# EAGLE board otterley_B_v1_2 (EAGLE 9.6.2)
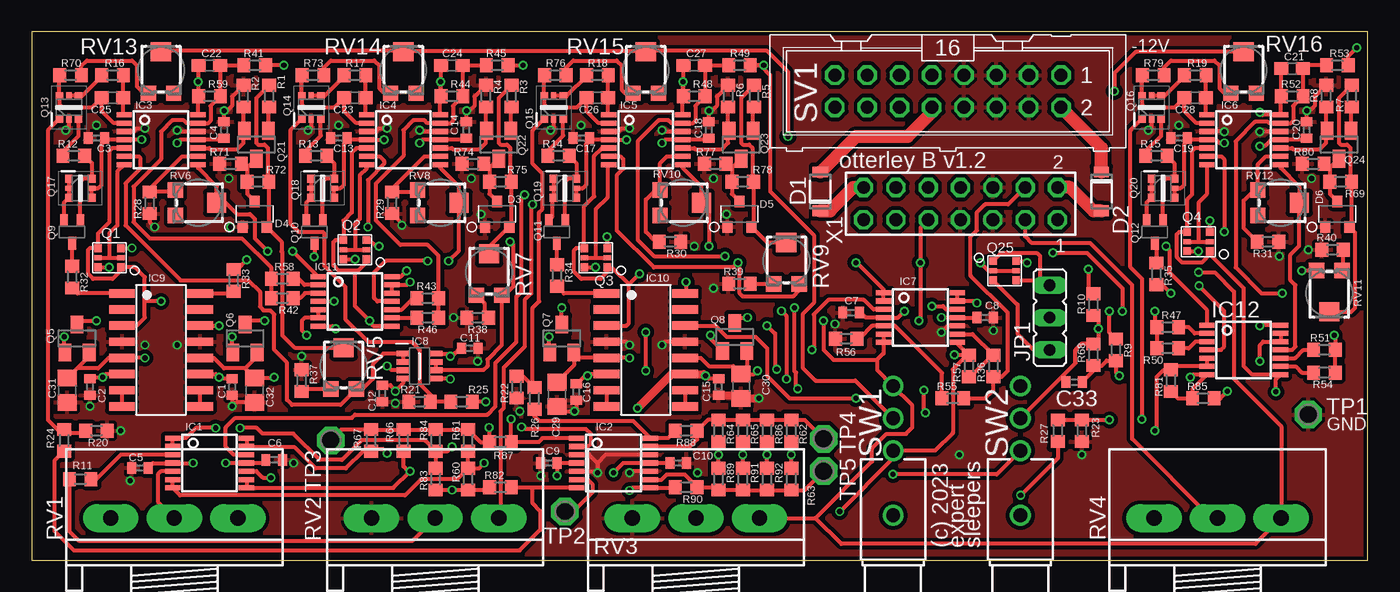
[diagram p6: board, top side]
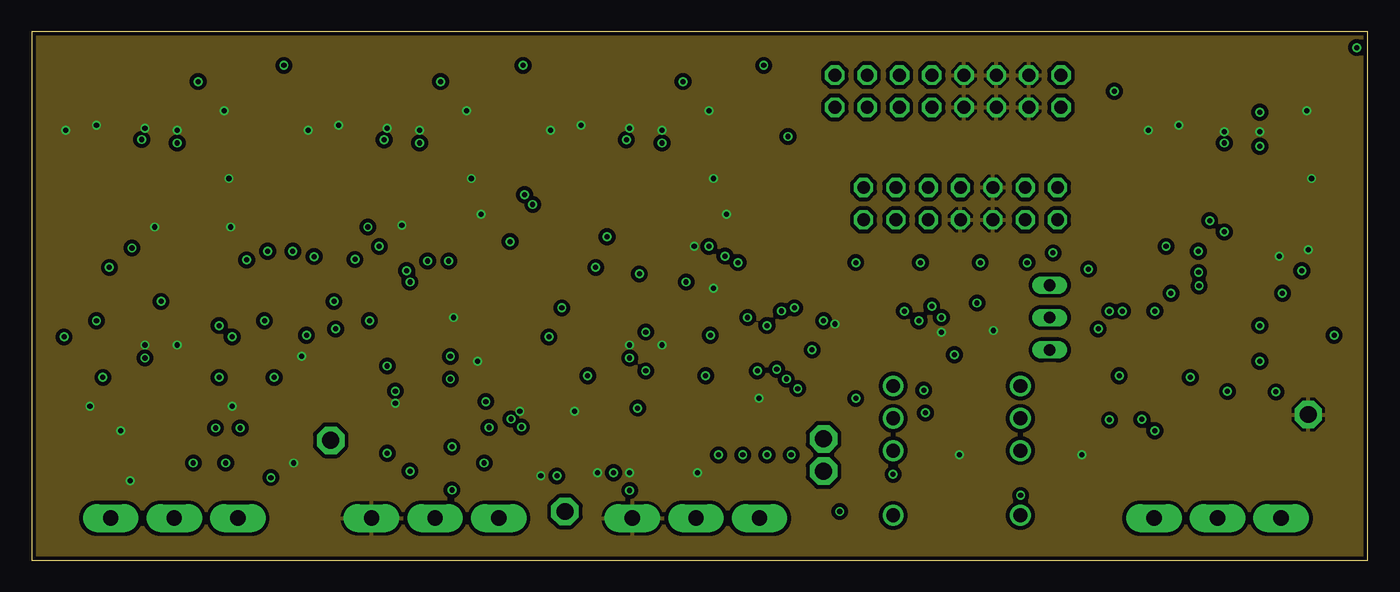
[diagram p7: board, inner layer Route2]
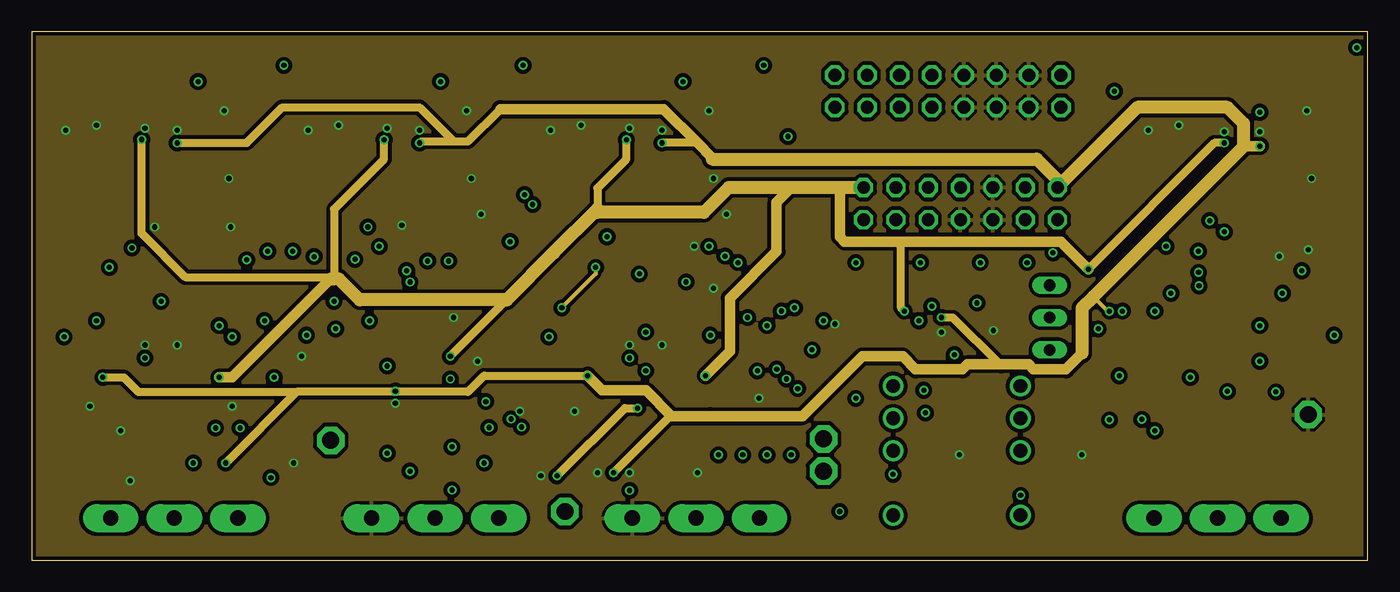
[diagram p8: board, inner layer Route15]
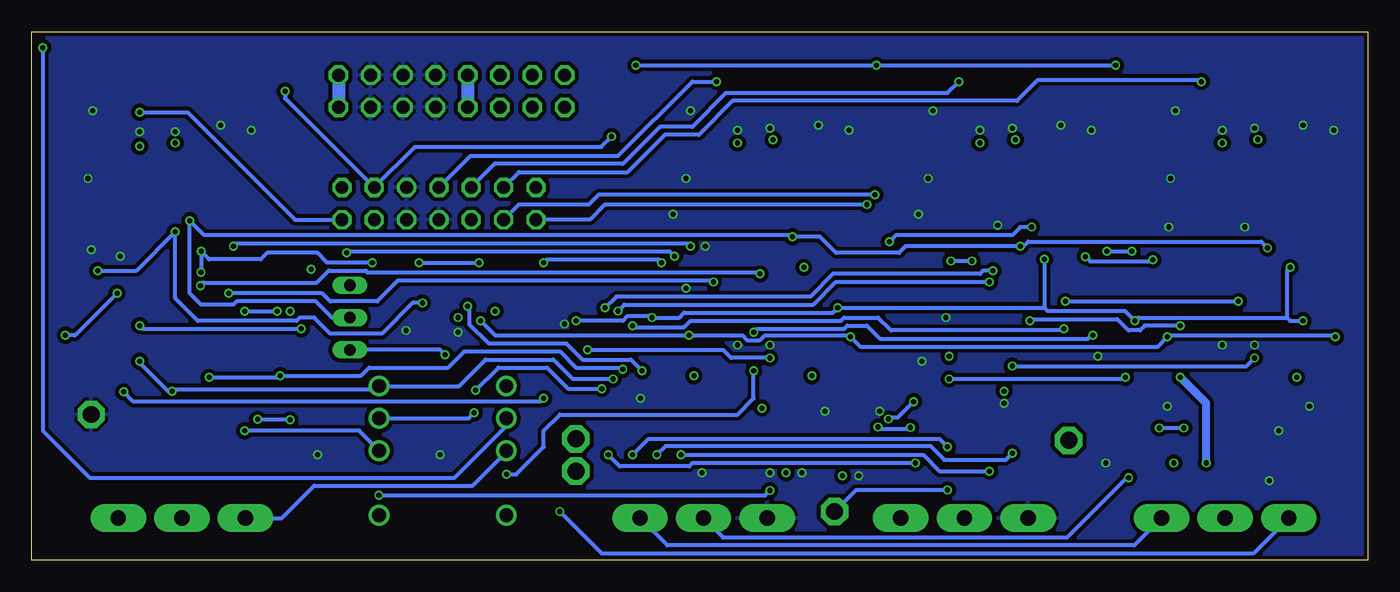
[diagram p9: board, bottom side, seen from below]

Size 105 x 41.5 mm. Coordinates in mm from the lower left corner, seen from the top.
Outline: 0,0 105,0 105,41.5 0,41.5 0,0
Copper layers (1+2*15+16): Top 0.035mm / dielectric 0.25mm / Route2 0.035mm / dielectric 1mm / Route15 0.035mm / dielectric 0.25mm / Bottom 0.035mm
Design rules "pcbtrain *": minimum track width 5mil, minimum drill 0.4mm, track to track 5mil, track to pad 5mil, pad to pad 5mil, via to via 5mil, smd to smd 5mil, copper to edge 0.25mm, drill to drill 8mil, minimum pad ring 0.15mm, minimum via ring 0.15mm, stop-mask expansion 4mil, vias tented up to drill 0mil, thermal gap 10mil

## Footprints (pad centres in the part's own frame; a part is rotated, then mirrored left to right if it is on the bottom)
C0402 = smd 0.7 x 0.9: 1 -0.65,0; 2 0.65,0
C0603 = smd 1.1 x 1: 1 -0.85,0; 2 0.85,0
C0805 = smd 1.3 x 1.5: 1 -0.95,0; 2 0.95,0
SOD123FL = smd 0.85 x 1.2: A 1.525,0; C -1.525,0
SOT-23 = smd 0.8 x 0.9: 1 -0.95,-1; 2 0.95,-1; 3 0,1
PW_R-PDSO-G14 = smd 0.4 x 1.2: 1 -1.95,-2.9; 2 -1.3,-2.9; 3 -0.65,-2.9; 4 0,-2.9; 5 0.65,-2.9; 6 1.3,-2.9; 7 1.95,-2.9; 8 1.95,2.9; 9 1.3,2.9; 10 0.65,2.9; 11 0,2.9; 12 -0.65,2.9; 13 -1.3,2.9; 14 -1.95,2.9
DDF0008A = smd 1.05 x 0.45: 1 -1.3,0.975; 2 -1.3,0.325; 3 -1.3,-0.325; 4 -1.3,-0.975; 5 1.3,-0.975; 6 1.3,-0.325; 7 1.3,0.325; 8 1.3,0.975
SO16 = smd 0.66 x 2.032: 1 -4.445,-3.073; 2 -3.175,-3.073; 3 -1.905,-3.073; 4 -0.635,-3.073; 5 0.635,-3.073; 6 1.905,-3.073; 7 3.175,-3.073; 8 4.445,-3.073; 9 4.445,3.073; 10 3.175,3.073; 11 1.905,3.073; 12 0.635,3.073; 13 -0.635,3.073; 14 -1.905,3.073; 15 -3.175,3.073; 16 -4.445,3.073
JP2 = drill 0.914 long: 1 -2.54,0; 2 0,0; 3 2.54,0
SOT363 = smd 0.6 x 0.6: 1 -0.9,0.75; 3 -0.9,-0.75; 4 0.9,-0.75; 6 0.9,0.75 | smd 0.6 x 0.4: 2 -0.9,0; 5 0.9,0
SOT23 = smd 1 x 1.4: 1 -0.95,-1.1; 2 0.95,-1.1; 3 0,1.1
SOT323 = smd 0.6 x 1: 1 -0.65,-0.9; 2 0.65,-0.9; 3 0,0.9
SOT65P210X110-6N = smd 0.6 x 0.6: 1 -0.9,0.75; 3 -0.9,-0.75; 4 0.9,-0.75; 6 0.9,0.75 | smd 0.6 x 0.4: 2 -0.9,0; 5 0.9,0
R0603 = smd 1 x 1.1: 1 -0.85,0; 2 0.85,0
RD1610NOA0X = drill 1.2 pad 2.184 long: 1 -5,3.8; 2 0,3.8; 3 5,3.8
TC33X = smd 1.2 x 1.2: 1 -1,-1.8; 3 1,-1.8 | smd 1.6 x 1.5: 2 0,1.45
ML16 = drill 1.016 octagon: 1 -8.89,-1.27; 2 -8.89,1.27; 3 -6.35,-1.27; 4 -6.35,1.27; 5 -3.81,-1.27; 6 -3.81,1.27; 7 -1.27,-1.27; 8 -1.27,1.27; 9 1.27,-1.27; 10 1.27,1.27; 11 3.81,-1.27; 12 3.81,1.27; 13 6.35,-1.27; 14 6.35,1.27; 15 8.89,-1.27; 16 8.89,1.27
2MS1T2B2M7RE = drill 1.092: 1 0,5.08; 2 0,7.62; 3 0,10.16; 7 0,0
P1-13 = drill 1.321 pad 2.159 octagon: TP 0,0
TSW-107-02-S-D = drill 1 pad 1.5 octagon: 1 7.62,-1.27; 2 7.62,1.27; 3 5.08,-1.27; 4 5.08,1.27; 5 2.54,-1.27; 6 2.54,1.27; 7 0,-1.27; 8 0,1.27; 9 -2.54,-1.27; 10 -2.54,1.27; 11 -5.08,-1.27; 12 -5.08,1.27; 13 -7.62,-1.27; 14 -7.62,1.27

## Placement (x,y rotation side)
C1  0.1uF  [C0402]  15.75,13.59 270 top
C2  0.1uF  [C0402]  4.57,13.59 90 top
C3  0.1uF  [C0402]  5.08,33.15 180 top
C4  0.1uF  [C0402]  15.11,33.78 270 top
C5  0.1uF  [C0402]  8.51,7.24 180 top
C6  0.1uF  [C0402]  19.05,7.87 180 top
C7  0.1uF  [C0402]  64.39,19.43 180 top
C8  0.1uF  [C0402]  74.93,19.05 180 top
C9  0.1uF  [C0402]  40.64,7.62 180 top
C10  0.1uF  [C0402]  50.8,7.62 180 top
C11  0.1uF  [C0402]  34.42,16.64 0 top
C12  0.1uF  [C0402]  27.56,13.08 90 top
C13  0.1uF  [C0402]  24.13,33.15 180 top
C14  0.1uF  [C0402]  34.16,33.78 270 top
C15  0.1uF  [C0402]  53.98,13.59 270 top
C16  0.1uF  [C0402]  42.8,13.21 90 top
C17  0.1uF  [C0402]  43.18,33.15 180 top
C18  0.1uF  [C0402]  53.21,33.78 270 top
C19  0.1uF  [C0402]  90.17,33.15 180 top
C20  0.1uF  [C0402]  100.2,33.78 270 top
C21  100pF  [C0603]  99.06,38.61 180 top
C22  100pF  [C0603]  13.97,38.86 180 top
C23  100pF  [C0603]  25.4,36.32 0 top
C24  100pF  [C0603]  33.02,38.86 180 top
C25  100pF  [C0603]  6.35,36.32 0 top
C26  100pF  [C0603]  44.45,36.32 0 top
C27  100pF  [C0603]  52.07,38.86 180 top
C28  100pF  [C0603]  91.44,36.32 0 top
C29  1uF 5%  [C0805]  41.27,13.02 270 top
C30  1uF 5%  [C0805]  55.75,13.65 270 top
C31  1uF 5%  [C0805]  2.79,13.34 270 top
C32  1uF 5%  [C0805]  17.53,13.34 270 top
C33  0.1uF  [C0402]  81.92,13.97 0 top
D1  RB060M-60  [SOD123FL]  61.98,28.96 90 top
D2  RB060M-60  [SOD123FL]  84.07,28.96 270 top
D3  BAW56L  [SOT-23]  36.58,27.18 0 top
D4  BAW56L  [SOT-23]  17.53,27.18 0 top
D5  BAW56L  [SOT-23]  55.63,27.18 0 top
D6  BAW56L  [SOT-23]  102.62,27.18 0 top
IC1  TL074CPW  [PW_R-PDSO-G14]  13.97,7.62 270 top
IC2  TL074CPW  [PW_R-PDSO-G14]  45.72,7.62 270 top
IC3  TL074CPW  [PW_R-PDSO-G14]  10.16,33.02 270 top
IC4  TL074CPW  [PW_R-PDSO-G14]  29.21,33.02 270 top
IC5  TL074CPW  [PW_R-PDSO-G14]  48.26,33.02 270 top
IC6  TL074CPW  [PW_R-PDSO-G14]  95.25,33.02 270 top
IC7  TL074CPW  [PW_R-PDSO-G14]  69.85,19.05 270 top
IC8  TL072HDDF  [DDF0008A]  30.48,15.24 0 top
IC9  LM13700M  [SO16]  10.16,16.51 270 top
IC10  LM13700M  [SO16]  48.26,16.51 270 top
IC11  CD4066BPW  [PW_R-PDSO-G14]  25.4,20.32 270 top
IC12  CD4066BPW  [PW_R-PDSO-G14]  95.25,16.51 270 top
JP1  I2C_EXP  [JP2]  80.01,19.05 90 top
Q1  NX6020CAKS  [SOT363]  6.1,23.75 180 top
Q2  NX6020CAKS  [SOT363]  25.4,24.38 180 top
Q3  NX6020CAKS  [SOT363]  44.32,23.75 180 top
Q4  NX6020CAKS  [SOT363]  91.69,25.02 180 top
Q5  2N7002  [SOT23]  3.56,17.4 0 top
Q6  2N7002  [SOT23]  16.76,17.4 0 top
Q7  2N7002  [SOT23]  41.66,17.4 0 top
Q8  2N7002  [SOT23]  55.24,17.53 0 top
Q9  BC859W  [SOT323]  3.17,25.78 180 top
Q10  BC859W  [SOT323]  22.23,25.78 180 top
Q11  BC859W  [SOT323]  41.27,25.78 180 top
Q12  BC859W  [SOT323]  88.27,25.78 180 top
Q13  PMP4201Y  [SOT65P210X110-6N]  2.92,35.56 90 top
Q14  PMP4201Y  [SOT65P210X110-6N]  21.97,35.56 90 top
Q15  PMP4201Y  [SOT65P210X110-6N]  41.02,35.56 90 top
Q16  PMP4201Y  [SOT65P210X110-6N]  88.01,35.56 90 top
Q17  PMP5201Y  [SOT65P210X110-6N]  3.81,29.21 0 top
Q18  PMP5201Y  [SOT65P210X110-6N]  22.86,29.21 0 top
Q19  PMP5201Y  [SOT65P210X110-6N]  41.91,29.21 0 top
Q20  PMP5201Y  [SOT65P210X110-6N]  88.9,29.21 0 top
Q21  MMBFJ202  [SOT23]  17.65,32.64 180 top
Q22  MMBFJ202  [SOT23]  36.7,32.64 180 top
Q23  MMBFJ202  [SOT23]  55.75,32.64 180 top
Q24  MMBFJ202  [SOT23]  102.74,32.64 180 top
Q25  NX6020CAKS  [SOT363]  76.45,22.73 0 top
R1  2K  [R0603]  18.67,36.45 90 top
R2  2K  [R0603]  16.64,36.45 270 top
R3  2K  [R0603]  37.72,36.45 90 top
R4  2K  [R0603]  35.69,36.45 270 top
R5  2K  [R0603]  56.77,36.45 90 top
R6  2K  [R0603]  54.74,36.45 270 top
R7  2K  [R0603]  103.76,36.45 90 top
R8  2K  [R0603]  101.73,36.45 270 top
R9  3K  [R0603]  85.22,16.51 270 top
R10  3K  [R0603]  83.44,20.07 90 top
R11  4K7  [R0603]  3.81,6.35 0 top
R12  4K7  [R0603]  3.3,31.75 0 top
R13  4K7  [R0603]  22.35,31.75 0 top
R14  4K7  [R0603]  41.4,31.75 0 top
R15  4K7  [R0603]  88.39,31.75 0 top
R16  470R  [R0603]  6.35,38.1 180 top
R17  470R  [R0603]  25.4,38.1 180 top
R18  470R  [R0603]  44.45,38.1 180 top
R19  470R  [R0603]  91.44,38.1 180 top
R20  620R  [R0603]  5.08,10.16 180 top
R21  620R  [R0603]  30.48,12.45 0 top
R22  620R  [R0603]  38.1,13.59 90 top
R23  620R  [R0603]  82.55,10.16 90 top
R24  27K  [R0603]  2.54,9.4 270 top
R25  27K  [R0603]  33.78,12.45 0 top
R26  27K  [R0603]  39.5,12.7 270 top
R27  27K  [R0603]  80.64,10.16 270 top
R28  2K  [R0603]  9.27,28.07 90 top
R29  2K  [R0603]  28.32,28.07 90 top
R30  2K  [R0603]  50.16,25.02 180 top
R31  2K  [R0603]  97.16,25.02 180 top
R32  12K  [R0603]  3.17,22.23 90 top
R33  12K  [R0603]  15.88,21.97 90 top
R34  12K  [R0603]  41.27,22.35 90 top
R35  12K  [R0603]  88.39,22.48 90 top
R36  20K  [R0603]  75.56,15.24 90 top
R37  82K  [R0603]  21.21,14.1 270 top
R38  82K  [R0603]  35.05,19.05 0 top
R39  82K  [R0603]  55.63,21.72 0 top
R40  82K  [R0603]  102.23,24.38 0 top
R41  10K  [R0603]  17.53,38.86 180 top
R42  10K  [R0603]  19.68,20.57 180 top
R43  10K  [R0603]  31.11,20.57 0 top
R44  10K  [R0603]  33.02,36.45 180 top
R45  10K  [R0603]  36.58,38.86 180 top
R46  10K  [R0603]  31.11,19.05 0 top
R47  10K  [R0603]  89.28,18.29 180 top
R48  10K  [R0603]  52.07,36.45 180 top
R49  10K  [R0603]  55.63,38.86 180 top
R50  10K  [R0603]  89.28,16.64 180 top
R51  10K  [R0603]  101.6,16.51 0 top
R52  10K  [R0603]  99.06,36.45 180 top
R53  10K  [R0603]  102.62,38.86 180 top
R54  10K  [R0603]  101.6,14.73 0 top
R55  10K  [R0603]  72.39,12.7 0 top
R56  10K  [R0603]  64.01,17.4 0 top
R57  10K  [R0603]  73.66,15.24 90 top
R58  10K  [R0603]  19.68,22.1 180 top
R59  10K  [R0603]  13.97,36.45 180 top
R60  110K  [R0603]  34.29,6.35 270 top
R61  110K  [R0603]  34.29,9.4 90 top
R62  110K  [R0603]  59.69,10.16 90 top
R63  110K  [R0603]  59.69,6.35 270 top
R64  169K  [R0603]  53.98,10.16 90 top
R65  169K  [R0603]  55.88,10.16 90 top
R66  309K  [R0603]  29.21,9.4 90 top
R67  309K  [R0603]  26.67,9.4 90 top
R68  18K  [R0603]  83.44,16.13 90 top
R69  1M  [R0603]  102.87,29.72 0 top
R70  1M  [R0603]  3.05,38.1 180 top
R71  1M  [R0603]  15.62,31.11 0 top
R72  1M  [R0603]  17.78,29.72 0 top
R73  1M  [R0603]  22.1,38.1 180 top
R74  1M  [R0603]  34.67,31.11 0 top
R75  1M  [R0603]  36.83,29.72 0 top
R76  1M  [R0603]  41.15,38.1 180 top
R77  1M  [R0603]  53.72,31.11 0 top
R78  1M  [R0603]  55.88,29.72 0 top
R79  1M  [R0603]  88.14,38.1 180 top
R80  1M  [R0603]  100.71,31.11 0 top
R81  100K  [R0603]  89.53,14.1 90 top
R82  100K  [R0603]  36.83,5.71 0 top
R83  100K  [R0603]  31.75,6.35 270 top
R84  100K  [R0603]  31.75,9.4 90 top
R85  100K  [R0603]  92.08,12.7 0 top
R86  100K  [R0603]  57.78,10.16 90 top
R87  100K  [R0603]  36.83,9.27 0 top
R88  100K  [R0603]  51.44,10.16 180 top
R89  100K  [R0603]  53.98,6.35 270 top
R90  100K  [R0603]  51.44,5.71 180 top
R91  100K  [R0603]  55.88,6.35 270 top
R92  100K  [R0603]  57.78,6.35 270 top
RV1  100K LIN  [RD1610NOA0X]  11.2,-0.5 0 top
RV2  100K LIN  [RD1610NOA0X]  31.7,-0.5 0 top
RV3  100K LIN  [RD1610NOA0X]  52.2,-0.5 0 top
RV4  10K LIN  [RD1610NOA0X]  93.2,-0.5 0 top
RV5  20K  [TC33X]  24.51,15.24 0 top
RV6  20K  [TC33X]  13.08,28.07 270 top
RV7  20K  [TC33X]  35.94,22.61 0 top
RV8  20K  [TC33X]  32.13,28.07 270 top
RV9  20K  [TC33X]  59.31,23.5 0 top
RV10  20K  [TC33X]  51.18,28.07 270 top
RV11  20K  [TC33X]  101.98,20.95 180 top
RV12  20K  [TC33X]  98.17,28.07 270 top
RV13  200K  [TC33X]  10.16,38.48 0 top
RV14  200K  [TC33X]  29.21,38.48 0 top
RV15  200K  [TC33X]  48.26,38.48 0 top
RV16  200K  [TC33X]  95.25,38.48 0 top
SV1  POWER  [ML16]  72.01,36.83 180 top
SW1  2MS3T2B2M7  [2MS1T2B2M7RE]  67.7,3.51 0 top
SW2  2MS3T2B2M7  [2MS1T2B2M7RE]  77.7,3.51 0 top
TP1  RA2  [P1-13]  100.33,11.43 0 top
TP2  RA2  [P1-13]  41.91,3.81 0 top
TP3  RA2  [P1-13]  23.5,9.4 0 top
TP4  RA2  [P1-13]  62.23,9.53 0 top
TP5  RA2  [P1-13]  62.23,6.99 0 top
X1  TSW-107-02-S-D  [TSW-107-02-S-D]  73,28 0 top

## Tracks (layer width: path | path; a pad name or v marks a point on that pad's centre or on a via)
+5V  (via drill 0.4)
  Top 0.305: IC7.6 IC7.7 66.95,16.23 66.43,15.71 | Q5.3 3.85,18.8 v5.08,18.8 | v18.29,18.8 17.19,18.8 Q6.3 | Q7.3 v41.66,19.81 | 61.59,3.3 66.04,7.75 66.04,8.76 67.18,9.91 68.71,9.91 69.22,10.41 69.22,12.15 SW1.3 66.43,14.94 66.43,15.71 | RV3.3 61.59,3.3 | 61.59,3.3 63.62,1.27 96.17,1.27 RV4.3 98.2,10.51 94.49,14.22 94.49,21.08 92.98,22.59 v91.71,22.59 | v6.1,22.99 6.08,23 Q1.6 | Q4.6 v91.68,24.27 v91.69,24.26 | Q8.3 55.67,19.05 v56.26,19.05 | v62.23,18.8 62.23,16.51 63.02,15.71 66.43,15.71 | Q25.6 78.12,23.48 v78.23,23.37 | Q2.6 25.39,23.63 v25.4,23.62 | Q3.6 v44.31,23 v44.32,22.99
  Route15 0.305: v44.32,22.99 44.32,22.48 v41.66,19.81
  Bottom 0.305: RV1.3 18.36,1.14 55.04,1.14 RV3.3 | 6.35,19.05 18.03,19.05 v18.29,18.8 19.05,19.56 25.15,19.56 25.4,19.81 | 25.4,19.81 v41.66,19.81 42.04,19.43 53.72,19.43 54.1,19.05 v56.26,19.05 56.39,19.18 58.17,19.18 58.55,18.8 v62.23,18.8 | v6.1,22.99 6.35,22.73 6.35,19.05 | v25.4,23.62 25.4,19.81 | v78.23,23.37 81.79,23.37 82.55,24.13 86.49,24.13 87,23.62 91.06,23.62 v91.69,24.26 91.69,22.61 v91.71,22.59 | 6.35,19.05 6.1,18.8 v5.08,18.8
+9V  (via drill 0.4)
  Top 0.305: R10.1 83.82,18.84 v83.82,18.16 83.82,17.36 R68.2 82.51,16.98 82.04,16.51 82.04,15.47 80.91,14.34 | SW2.2 80.91,14.34 | IC12.14 96.56,18.46 v96.52,18.41 | IC11.14 29,22.27 v29.46,22.73 | v70.23,11.56 70.1,11.68 v70.1,13.34 | v60.2,13.46 60.07,13.59 60.07,14.73 59.94,14.86 v59.94,19.81 | C33.1 81.27,13.98 80.91,14.34
  Bottom 0.305: v96.52,18.41 96.27,18.16 v83.82,18.16 | SW2.2 70.66,11.13 v70.23,11.56 | v70.1,13.34 68.33,15.11 64.52,15.11 62.87,13.46 v60.2,13.46 | v29.46,22.73 30.23,22.73 30.48,22.48 42.04,22.48 43.81,20.7 59.05,20.7 v59.94,19.81
+10V  (via drill 0.4)
  Top 0.305: RV13.2 10.14,40.01 29.13,40.01 | 29.13,40.01 48.19,40.01 RV15.2 48.33,40.01 57.78,40.01 59.44,38.35 v59.44,33.27 | RV14.2 29.13,40.01 | RV16.2 86.79,39.93 85.09,38.23 v85.09,36.83 | R55.2 74.91,12.7 75.56,13.36 R36.1 76.24,14.39 76.71,14.86 76.71,19.43 73.79,22.35 73.79,25.4 74.3,25.91 74.3,27.3 74.93,27.94 76.75,27.94 X1.4
  Bottom 0.305: v59.44,33.27 60.25,32.46 74.89,32.46 X1.4 85.09,36.28 v85.09,36.83
+12V  (via drill 0.4)
  Top 0.305: Q17.4 Q17.5 5.22,29.21 5.46,29.45 5.46,32.64 5.84,33.02 5.86,33.02 | 5.86,33.02 IC3.4 7.28,33.04 v8.64,33.04 | 5.86,33.02 C3.1 | IC2.4 C9.1 41.29,6.62 v41.27,6.6 | Q18.4 Q18.5 24.27,29.21 24.51,29.45 24.51,32.64 24.89,33.02 24.91,33.02 | 24.91,33.02 IC4.4 v27.69,33.02 | 24.91,33.02 C13.1 | Q19.4 Q19.5 43.32,29.21 43.56,29.45 43.56,32.64 43.94,33.02 43.96,33.02 | 43.96,33.02 IC5.4 v46.74,33.02 | 43.96,33.02 C17.1 | 90.95,33.02 IC6.4 93.09,33.02 93.34,32.77 v93.73,32.77 | 90.95,33.02 C19.1 | 90.95,33.02 90.93,33.02 90.55,32.64 90.55,29.45 90.31,29.21 Q20.5 Q20.4 | C7.1 65.17,19.43 65.55,19.05 IC7.4 68.07,19.05 v68.58,19.56 | C5.1 9.54,7.62 IC1.4 v12.7,7.62 | R10.2 83.06,20.97 v83.06,22.86 | C11.1 33.64,16.64 33.22,16.21 | 33.22,16.21 33.01,16 v32.89,16 | IC9.11 14.48,14.61 v14.73,14.35 14.84,14.24 C1.1 | IC8.8 33.22,16.21 | C15.1 53.2,14.24 52.83,14.61
  Top 0.61: v47.62,11.94 50.29,14.61 IC10.11 52.83,14.61 v52.96,14.48
  Top 1.016: D1.C 62.74,27.43 64.58,29.27 X1.14
  Route15 0.61: v27.69,33.02 27.69,31.5 23.75,27.56 23.75,22.1 | v46.74,33.02 46.74,31.5 44.45,29.21 44.45,27.56 44.45,27.3 | v93.73,32.77 92.96,32.77 v83.06,22.86 | v68.58,19.56 68.33,19.81 68.33,25.02 | v8.64,33.04 8.64,25.65 12.06,22.23 24,22.23 24.13,22.1 | v41.27,6.6 46.61,11.94 v47.62,11.94 | v32.89,16 41.02,24.13
  Route15 0.813: 63.5,29.27 63.5,25.4 63.88,25.02 68.33,25.02 80.9,25.02 v83.06,22.86 | v14.73,14.35 15.75,14.35 23.5,22.1 | v52.96,14.48 54.86,16.38 54.86,20.57 58.55,24.26 58.55,28.13 59.69,29.27
  Route15 1.016: 44.45,27.3 52.83,27.3 54.8,29.27 59.69,29.27 63.5,29.27 X1.14 | 44.45,27.56 41.02,24.13 37.34,20.45 25.78,20.45 24.13,22.1 23.75,22.1 23.5,22.1
  Bottom 0.61: v12.7,7.62 12.7,12.32 v14.73,14.35
-5V  (via drill 0.4)
  Top 0.305: IC7.8 72.75,17 R57.2 | R57.2 73.49,16.09 72.39,14.99 72.39,9.98 71,8.59 SW1.1 67.7,8.01 v63.5,3.81 | R57.2 72.56,16.09 v72.52,16.13 | Q25.3 77.47,20.07 77.47,17.78 78.74,16.51 JP1.1
  Bottom 0.305: RV4.1 85.35,3.3 82.8,5.84 70.36,5.84 67.7,8.5 SW1.1 | RV1.1 8.99,0.51 60.2,0.51 v63.5,3.81 | v72.52,16.13 72.9,16.51 JP1.1
-9V  (via drill 0.4)
  Top 0.305: v91.06,14.35 91.27,14.56 IC12.7 91.22,13.44 R85.1 90.08,12.7 R81.1 | v85.47,14.48 85.22,14.73 R9.2 84.49,15.66 84.11,15.28 83.82,15.28 | IC11.7 23.64,18.37 23.85,18.16 v23.88,18.16 | v58.55,14.99 58.42,15.11 58.42,17.78 v57.78,18.41 | R68.1 83.82,15.28 | C33.2 82.56,14.02 83.82,15.28
  Bottom 0.305: v91.06,14.35 85.6,14.35 v85.47,14.48 79.12,14.48 78.49,15.11 72.26,15.11 70.99,16.38 63.5,16.38 62.23,15.11 58.67,15.11 v58.55,14.99 | v23.88,18.16 24,18.03 37.47,18.03 38.48,19.05 41.15,19.05 41.4,18.8 53.21,18.8 53.72,18.29 57.66,18.29 v57.78,18.41
-12V  (via drill 0.4)
  Top 0.305: C4.2 14.87,33.02 IC3.11 11.68,33.02 v11.43,32.77 | C10.2 IC2.11 46.48,7.62 v45.72,6.86 | C14.2 33.92,33.02 IC4.11 30.73,33.02 v30.48,32.77 | C18.2 52.97,33.02 IC5.11 49.78,33.02 v49.53,32.77 | C20.2 99.96,33.02 IC6.11 97.41,33.02 96.9,32.51 v96.52,32.51 | C8.2 IC7.11 v71.5,19.05 | C6.2 18.15,7.62 IC1.11 v15.24,7.62 | C2.2 4.76,14.35 v5.59,14.35 5.84,14.61 IC9.6 | C16.2 43.47,14.48 v43.69,14.48 43.81,14.61 IC10.6 | IC8.4 29.18,13.88 28.61,13.3 | 28.61,13.3 v28.57,13.27 | C12.2 28.18,13.73 28.61,13.3 | R9.1 84.71,17.87 v84.71,19.56
  Top 1.016: D2.A 83.44,27.43 81.6,29.27 X1.2
  Route15 0.305: v84.71,19.56 84.58,19.56 83.44,20.7
  Route15 0.61: 52.32,32.77 v49.53,32.77 | v5.59,14.35 7.24,14.35 8.38,13.21 20.83,13.21 | v43.69,14.48 35.56,14.48 34.29,13.21 28.64,13.21 v28.57,13.27 28.51,13.21 20.83,13.21 | 20.83,13.21 v15.24,7.62 | v45.72,6.86 50.16,11.3 53.34,11.3 | v30.48,32.77 30.61,32.89 33.15,32.89 | 33.15,32.89 30.48,35.56 19.68,35.56 16.89,32.77 v11.43,32.77 | 33.15,32.89 34.29,32.89 36.83,35.43 | 76.2,15.37 76.07,15.37 72.39,19.05 v71.5,19.05
  Route15 0.813: 36.83,35.43 49.66,35.43 52.32,32.77 53.47,31.62 53.47,31.5 | v43.69,14.48 44.83,13.34 48.26,13.34 50.29,11.3 53.34,11.3 60.58,11.3 65.28,16 68.45,16 69.47,14.99 73.15,14.99 73.53,15.37 76.2,15.37 78.36,15.37 78.74,14.99 81.28,14.99 82.55,16.26 | v96.52,32.51 95.25,32.51 | 95.31,32.58 95.25,32.64
  Route15 1.016: 53.47,31.5 78.99,31.5 80.62,29.87 X1.2 86.91,35.56 93.98,35.56 95.25,34.29 95.25,32.64 | 95.31,32.58 95.25,32.51 83.44,20.7 82.55,19.81 82.55,16.26
GND  (via drill 0.4)
  Top 0.305: v11.43,33.78 11.56,33.66 13.04,33.66 IC3.12 | Q13.2 2.92,34.04 v2.67,33.78 | IC3.3 8.02,33.67 8.26,33.91 v8.89,33.91 | R28.1 9.27,26.54 v9.65,26.16 | C4.1 v15.11,35.31 15.37,35.31 15.75,35.69 15.75,36.41 R2.1 | IC4.12 32.09,33.66 30.73,33.66 v30.48,33.78 | Q14.2 21.97,34.04 v21.72,33.78 | IC4.3 27.07,33.67 27.3,33.91 v27.94,33.91 | R29.1 29.08,26.45 v29.08,26.29 | C14.1 v34.16,35.31 34.42,35.31 34.8,35.69 34.8,36.41 R4.1 | v49.53,33.78 49.66,33.66 51.15,33.66 IC5.12 | Q15.2 41.02,34.04 v40.77,33.78 | IC5.3 46.12,33.67 46.35,33.91 v46.99,33.91 | v46.99,16.89 46.74,17.14 IC10.4 | C18.1 v53.21,35.31 53.47,35.31 53.85,35.69 53.85,36.41 R6.1 | IC6.12 98.14,33.66 v96.52,33.66 | Q16.2 88.01,34.04 v87.76,33.78 | v93.73,33.66 93.71,33.67 IC6.3 | C20.1 v100.2,35.31 100.46,35.31 100.84,35.69 100.84,36.41 R8.1 | IC2.10 47.1,6.97 v46.99,6.86 | IC2.5 44.34,6.97 v44.45,6.86 44.45,7.62 | IC2.3 43.8,8.27 44.45,7.62 | IC2.12 45.1,8.27 44.45,7.62 | IC7.10 71.99,18.4 v71.5,17.91 | IC10.13 49.78,17.14 v49.53,16.89 | C29.2 41.66,11.68 v42.67,11.68 42.8,11.81 C16.1 | C32.2 16.07,12.38 v15.75,12.06 C1.2
  Top 0.61: C15.2 55.51,12.94 C30.2 v57.15,12.7
  other vias: 4.57,12.06 8.89,16.89 5.08,34.16 15.49,29.97 21.21,16 72.9,8.26 40.01,6.6 52.32,6.86 7.75,6.22 20.57,7.62 24.13,34.16 34.54,29.97 33.15,19.05 43.18,34.16 52.07,24.64 53.59,29.97 54.61,27.18 90.17,34.16 98.04,23.88 100.58,29.97 100.33,24.38 75.56,18.03 63.12,18.54 82.55,8.26 38.35,11.68 6.99,10.16 28.57,12.32 11.43,16.89 15.62,26.16 35.31,27.18 35.05,15.62 53.59,21.34
  pour Top (isolate 0.305): 0,0 105,0 105,41.5 0,41.5
  pour Bottom (isolate 0.305): 0,0 105,0 105,41.5 0,41.5
  pour Route2 (isolate 0.305): 0,0 105,0 105,41.5 0,41.5
  pour Route15 (isolate 0.305): 0,0 105,0 105,41.5 0,41.5
LFO_A1_CV
  Top 0.305: IC2.7 39.37,5.67 | 39.37,5.67 37.73,5.67 R82.2 | R24.2 1.78,7.79 1.78,2.29 3.3,0.76 38.35,0.76 40.01,2.41 40.01,3.81 39.37,4.45 39.37,5.67
LFO_A1_OUT  (via drill 0.4)
  Top 0.305: 13.12,36.83 R59.2 13.08,36.49 v13.08,37.59 | 13.12,36.83 C22.2 | IC3.14 13.06,36.77 13.12,36.83
  Bottom 0.305: v13.08,37.59 13.21,37.72 25.91,37.72 27.56,36.07 49.91,36.07 52.58,33.4 55.24,33.4 58.17,30.48 66.71,30.48 X1.12
LFO_A1_RAW_SIN
  Top 0.305: Q21.2 16.64,33.8 | 16.64,33.8 R2.2 | IC3.10 13.95,32.37 14.08,32.24 16.11,32.24 16.64,32.77 16.64,33.8
LFO_A1_SIN  (via drill 0.4)
  Top 0.305: IC3.8 13.06,30.81 14.53,29.34 RV6.2 15.24,28.07 16.13,27.18 17.14,27.18 17.53,26.8 17.53,25.27 v18.54,24.26 | v20.51,24.26 IC11.1
  Bottom 0.305: v20.51,24.26 v18.54,24.26
LFO_A1_SQ  (via drill 0.4)
  Top 0.305: IC3.5 6.33,32.37 6.1,32.13 6.1,26.54 5.2,25.64 Q1.4 4.56,24.5 4.41,24.34 4.41,22.52 4.83,22.1 6.35,22.1 7,22.75 Q1.1 8.12,23 8.89,22.23 8.89,20.32 | IC9.3 8.26,18.41 8.89,19.05 8.89,20.32 | IC11.4 v23.75,20.32 | v10.16,20.32 8.89,20.32
  Bottom 0.305: v23.75,20.32 v10.16,20.32
LFO_A1_TRI
  Top 0.305: IC3.6 8.41,31.72 8.51,31.62 8.51,30.73 7.37,29.59 7.37,26.29 11.68,21.97 17.02,21.97 17.93,21.06 17.93,19.91 18.22,19.62 18.73,19.62 19.05,19.3 19.05,16.51 20.07,15.49 20.07,12.57 20.45,12.19 24.26,12.19 RV5.3 26.01,13.44 26.8,14.22 26.8,15.37 27.64,16.21 IC8.1 IC8.2
LFO_A2_CV  (via drill 0.4)
  Top 0.305: IC2.1 40.14,9.57 39.84,9.27 R87.2 37.68,11.05 v37.66,11.08 | v35.69,12.45 R25.2
  Bottom 0.305: v37.66,11.08 37.53,11.21 36.93,11.21 v35.69,12.45
LFO_A2_OUT  (via drill 0.4)
  Top 0.305: 32.17,36.83 R44.2 32.13,36.49 v32.13,37.59 | 32.17,36.83 C24.2 | IC4.14 32.11,36.77 32.17,36.83
  Bottom 0.305: v32.13,37.59 33.02,36.7 50.42,36.7 53.09,34.04 55.63,34.04 58.55,31.11 68.57,31.11 68.58,31.12 68.61,31.12 X1.10
LFO_A2_RAW_SIN
  Top 0.305: Q22.2 35.69,33.8 | 35.69,33.8 R4.2 | IC4.10 33,32.37 33.13,32.24 35.16,32.24 35.69,32.77 35.69,33.8
LFO_A2_SIN  (via drill 0.4)
  Top 0.305: IC4.8 32.11,30.81 33.58,29.34 RV8.2 33.58,24.31 v32.77,23.5 | IC11.11 27.18,20.32 26.92,20.57 26.92,22.61 27.81,23.5 v31.11,23.5
  Bottom 0.305: v32.77,23.5 v31.11,23.5
LFO_A2_SQ  (via drill 0.4)
  Top 0.305: Q2.1 26.3,23.38 25.65,22.73 25.4,22.73 | 25.4,22.73 24.13,22.73 23.71,23.15 23.71,24.98 23.86,25.13 Q2.4 24.5,26.66 25.15,27.3 25.15,32 25.51,32.37 IC4.5 | IC11.8 26.88,18.37 26.54,18.71 v26.54,18.8 25.4,19.94 25.4,22.73 | IC9.14 v14.73,18.41
  Bottom 0.305: v14.73,18.41 17.53,18.41 17.9,18.04 18.8,18.04 19.68,18.92 26.42,18.92 v26.54,18.8
LFO_A2_TRI  (via drill 0.4)
  Top 0.305: IC8.7 IC8.6 35.49,14.91 35.81,15.24 35.81,15.75 36.94,16.88 36.94,20.57 | IC4.6 27.34,31.72 27.69,31.37 27.69,31.11 26.42,29.84 v26.42,26.16 | RV7.3 36.94,20.57 | v37.59,25.02 37.85,24.77 37.85,21.48 36.94,20.57
  Bottom 0.305: v26.42,26.16 27.31,26.16 27.93,25.54 37.08,25.54 v37.59,25.02
LFO_A3_CV
  Top 0.305: R88.2 49.99,9.57 IC2.14 47.27,10.92 39.88,10.92 39.5,11.3 R26.2
LFO_A3_OUT  (via drill 0.4)
  Top 0.305: 51.22,36.83 R48.2 51.18,36.49 v51.18,37.59 | 51.22,36.83 C27.2 | IC5.14 51.16,36.77 51.22,36.83
  Bottom 0.305: v51.18,37.59 53.09,37.59 58.93,31.75 70.52,31.75 X1.8
LFO_A3_RAW_SIN
  Top 0.305: Q23.2 54.74,33.8 | 54.74,33.8 R6.2 | IC5.10 52.05,32.37 52.18,32.24 54.21,32.24 54.74,32.77 54.74,33.8
LFO_A3_SIN  (via drill 0.4)
  Top 0.305: IC5.8 51.16,30.81 52.63,29.34 RV10.2 53.21,27.48 v53.21,24.64 | v89.15,24.64 89.41,24.38 89.41,22.61 92.35,19.66 IC12.1
  Bottom 0.305: v89.15,24.64 88.91,24.88 53.46,24.88 v53.21,24.64
LFO_A3_SQ  (via drill 0.4)
  Top 0.305: Q3.1 45.22,22.86 | 45.22,22.86 45.22,22.62 44.7,22.1 43.18,22.1 42.63,22.64 42.63,24.34 42.79,24.5 Q3.4 43.42,27.8 44.2,28.57 44.2,31.75 44.82,32.37 IC5.5 | 46.93,21.65 45.72,22.86 45.22,22.86 | IC12.4 93.47,16.51 93.73,16.76 93.73,19.56 v91.75,21.54 | v47.75,22.48 46.93,21.65 | IC10.3 46.74,18.41 46.93,18.61 46.93,21.65
  Bottom 0.305: v91.75,21.54 91.49,21.79 82.6,21.79 81.66,22.73 78.74,22.73 78.61,22.6 47.87,22.6 v47.75,22.48
LFO_A3_TRI  (via drill 0.4)
  Top 0.305: IC5.6 46.26,31.72 46.48,31.5 46.48,30.73 45.97,30.23 45.97,25.91 48.9,22.99 55.12,22.99 v55.5,23.37 55.63,23.24 55.63,20.95 55.88,20.7 59.82,20.7 60.31,21.19 RV9.3 | IC7.2 IC7.1 66.95,21.25 64.84,23.37 v64.77,23.37
  Bottom 0.305: v55.5,23.37 55.75,23.62 64.52,23.62 v64.77,23.37
LFO_A4_CV  (via drill 0.4)
  Top 0.305: R27.2 80.64,8 v77.72,5.08 | R90.2 50.54,5.67 IC2.8 47.2,5.67 v46.99,5.46
  Bottom 0.305: v77.72,5.08 47.37,5.08 v46.99,5.46
LFO_A4_OUT  (via drill 0.4)
  Top 0.305: R52.2 98.21,36.83 | 98.21,36.83 C21.2 | 98.21,36.83 98.15,36.77 IC6.14 96.73,34.97 v96.52,35.18
  Bottom 0.305: X1.1 84.3,26.73 92.75,35.18 v96.52,35.18
LFO_A4_RAW_SIN
  Top 0.305: Q24.2 101.73,33.8 | 101.73,33.8 R8.2 | IC6.10 99.04,32.37 99.17,32.24 101.2,32.24 101.73,32.77 101.73,33.8
LFO_A4_SIN
  Top 0.305: IC6.8 98.15,30.82 99.62,29.34 RV12.2 99.62,24.69 98.93,24 98.93,21.97 99.31,21.59 99.31,16.76 99.06,16.51 IC12.11
LFO_A4_SQ  (via drill 0.4)
  Top 0.305: 92.59,24.02 91.95,23.37 90.42,23.37 90,23.79 90,25.61 90.16,25.77 Q4.4 90.79,28.31 91.19,28.7 91.19,32.13 91.42,32.37 IC6.5 | Q4.1 92.59,24.02 | 92.59,24.02 95.25,21.36 95.25,15.24 95.93,14.56 IC12.8 97.79,14.2 v97.79,13.21 | v64.77,12.7 59.56,12.7 57.78,14.48 57.78,16.64 56.9,17.53 54.61,17.53 53.72,18.41 IC10.14
  Bottom 0.305: v64.77,12.7 65.02,12.45 97.03,12.45 v97.79,13.21
LFO_A4_TRI  (via drill 0.4)
  Top 0.305: IC7.14 IC7.13 74.14,20.35 v74.3,20.19 | IC6.6 93.5,31.72 93.73,31.5 v93.73,25.78 | v99.82,22.73 99.84,22.75 RV11.3
  Bottom 0.305: v99.82,22.73 96.77,22.73 v93.73,25.78 93.73,20.57 91.95,18.8 84.2,18.8 83.95,19.05 82.8,19.05 81.53,17.78 77.47,17.78 75.06,20.19 v74.3,20.19
N$1
  Top 1.016: D2.C 84.07,32.38 SV1.2
  Bottom 1.016: SV1.1 SV1.2
N$3
  Top 0.305: IC9.8 IC9.7
N$4
  Top 0.305: IC12.9 99.34,15.21 99.82,14.73 R54.1
N$5
  Top 0.305: IC11.3 21.48,20.97 21.08,20.57 R42.1
N$6
  Top 0.305: Q25.4 79.24,21.98 | 79.24,21.98 79.62,21.98 JP1.3 | Q25.1 76.2,24.13 78.99,24.13 79.24,23.89 79.24,21.98
N$7
  Top 0.305: IC1.5 10.14,6.97 9.91,6.73 9.91,4.59 RV1.2
N$8
  Top 0.305: IC11.9 30.27,19.02 R46.1
N$9
  Top 0.305: R11.1 2.96,2.25 3.68,1.52 29.92,1.52 RV2.2
N$10
  Top 0.305: R56.2 65.04,17.4 66.04,18.4 IC7.5 67.83,18.4 71.54,14.69 R55.1
N$11
  Top 0.305: IC9.9 IC9.10
N$12
  Top 0.305: IC10.7 IC10.8
N$13
  Top 0.305: IC7.9 73.94,17.75 75.56,16.13 R36.2 75.48,16.09 73.78,14.39 R57.1
N$14  (via drill 0.4)
  Top 0.305: 3.56,15.05 5.21,15.05 6.04,15.88 IC9.5 v8.89,15.88 | 3.56,15.05 C31.1 | Q5.2 4.51,16 3.56,15.05 | IC8.3 28.27,14.91 v27.94,15.24
  Bottom 0.305: v27.94,15.24 9.53,15.24 v8.89,15.88
N$15
  Top 1.016: SV1.10 70.74,35.18 68.83,33.27 64.77,33.27 D1.A
  Bottom 1.016: SV1.9 SV1.10
N$16
  Top 0.305: IC10.10 IC10.9
N$17
  Top 0.305: IC12.3 91.45,17.16 90.93,16.64 R50.1
N$24
  Top 0.305: IC9.1 3.6,20.95 R32.1
N$26
  Top 0.305: IC3.2 6.45,34.32 5.5,35.27 C25.1 4.74,35.56 2.41,35.56 2.17,35.8 Q13.6 2.17,38.07 R70.2
N$27
  Top 0.305: IC3.1 7.2,35.03 C25.2 R16.1
N$28
  Top 0.305: Q13.5 Q13.4 3.95,36.46 5.5,38.01 R16.2
N$31  (via drill 0.4)
  Top 0.305: 35.94,9.27 35.27,9.27 R61.2 R84.2 R66.2 R67.2 24.34,10.25 TP3.TP | 35.94,9.27 R87.1 | IC2.2 43.72,8.92 43.94,9.14 43.94,9.91 43.56,10.29 38.65,10.29 v38.48,10.45 | v35.94,10.41 35.94,9.27
  Bottom 0.305: v35.94,10.41 36.03,10.32 38.35,10.32 v38.48,10.45
N$32
  Top 0.305: IC1.3 7,8.27 5.08,6.35 R11.2
N$33
  Top 0.305: R32.2 Q9.3
N$34
  Top 0.305: R12.1 2.45,32.13 3.67,33.35 Q13.3
N$35
  Top 0.305: Q9.1 3.81,29.72 4.05,29.96 Q17.6 4.71,31.19 R12.2
N$36
  Top 0.305: Q17.1 Q17.2 Q17.3 2.52,28.07 Q9.2
N$37
  Top 0.305: IC3.9 11.82,31.72 9.27,29.17 R28.2 11.13,28.92 RV6.1
N$39
  Top 0.305: R37.2 21.4,13.44 RV5.1
N$40
  Top 0.305: R1.2 17.65,36.28 17.65,32.77 17.78,32.64 18.29,32.64 18.54,32.38 18.54,29.81 R72.2 18.63,26.33 D4.2 19.63,25.02 19.63,24.25 19.68,24.2 19.68,17.65 20.65,16.69 RV5.2
N$42
  Top 0.305: Q21.3 16.93,30.82 R72.1 | R72.1 16.93,28.77 D4.3 | R71.2 16.93,30.66 R72.1
N$43
  Top 0.305: R41.2 C22.1 R59.1 14.06,35.69 14.06,34.51 13.87,34.32 IC3.13 12.16,34.32 11.94,34.54 11.05,34.54 10.16,33.66 10.16,31.5 8,29.34 8,26.54 9.27,25.27 16.51,25.27 18.84,22.95 R58.2 R42.2
N$44
  Top 0.305: Q21.1 18.6,35.53 R1.1
N$48
  Top 0.305: IC11.2 21.43,21.62 20.95,22.1 R58.1
N$49
  Top 0.305: R70.1 3.9,38.82 4.32,39.24 7.87,39.24 8.26,38.86 8.26,37.2 8.78,36.68 RV13.1
N$51
  Top 0.305: Q13.1 1.27,33.76 1.27,11.01 2.33,9.95 2.84,9.95 | 2.84,9.95 R24.1 | R20.2 4.02,9.95 2.84,9.95
N$52  (via drill 0.4)
  Top 0.305: R82.1 35.77,5.5 R60.2 v33.02,5.5 R83.2 | IC2.6 43.72,6.32 44.07,5.97 44.07,5.33 42.55,3.81 TP2.TP
  Bottom 0.305: TP2.TP 40.22,5.5 v33.02,5.5
N$53
  Top 0.305: Q1.5 6.1,23.75 | 6.1,23.75 Q1.2 | IC3.7 6.73,30.54 6.73,26.29 6.1,25.65 6.1,23.75
N$57  (via drill 0.4)
  Top 0.305: IC1.10 16.89,6.99 17.65,6.99 18.16,6.48 v18.8,6.48
  Bottom 0.305: RV3.2 50.68,1.78 23.62,1.78 18.92,6.48 v18.8,6.48
N$75  (via drill 0.4)
  Top 0.305: IC9.12 14.29,15.88 15.11,15.05 16.76,15.05 | 16.76,15.05 C32.1 18.98,14.29 v19.05,14.35 | Q6.2 17.71,16 16.76,15.05 | IC8.5 32.85,14.27 v32.89,14.22
  Bottom 0.305: v32.89,14.22 19.18,14.22 v19.05,14.35
N$90
  Top 0.305: IC2.13 51.72,8.92 52.28,9.49 R88.1 53.13,11.01 R64.2 R65.2 R86.2 R62.2 60.74,11.01 TP4.TP
N$91
  Top 0.305: IC2.9 49.5,6.32 49.91,6.73 51.31,6.73 52.28,5.75 R90.1 53.76,5.71 R89.2 R91.2 R92.2 R63.2 60.74,5.5 TP5.TP
N$93
  Top 0.305: IC9.16 15.71,20.95 R33.1
N$94
  Top 0.305: IC4.2 25.5,34.32 24.55,35.27 C23.1 23.79,35.56 21.46,35.56 21.22,35.8 Q14.6 21.22,38.07 R73.2
N$95
  Top 0.305: IC4.1 26.25,35.03 C23.2 R17.1
N$96
  Top 0.305: Q14.5 Q14.4 23,36.46 24.55,38.01 R17.2
N$97  (via drill 0.4)
  Top 0.305: Q10.3 22.23,23.86 v22.2,23.84 | v16.89,23.58 16.13,22.82 R33.2
  Bottom 0.305: v22.2,23.84 21.82,23.46 17.02,23.46 v16.89,23.58
N$98
  Top 0.305: Q10.1 22.86,26.68 22.86,29.72 23.1,29.96 Q18.6 23.76,31.19 R13.2
N$99
  Top 0.305: Q18.1 Q18.2 Q18.3 21.57,28.07 Q10.2
N$100
  Top 0.305: R13.1 21.5,32.13 22.72,33.35 Q14.3
N$101
  Top 0.305: RV7.1 35.58,20.17 35.58,19.38 R38.2
N$102
  Top 0.305: R3.2 36.7,36.28 36.7,32.77 36.83,32.64 37.34,32.64 37.59,32.38 37.59,29.81 R75.2 37.68,26.33 D3.2 35.94,24.59 RV7.2
N$103
  Top 0.305: Q22.3 35.98,30.82 R75.1 | R75.1 35.98,28.77 D3.3 | R74.2 35.98,30.66 R75.1
N$104
  Top 0.305: Q22.1 37.65,35.53 R3.1
N$105
  Top 0.305: IC4.9 30.87,31.72 28.32,29.17 R29.2 30.18,28.92 RV8.1
N$107
  Top 0.305: R45.2 C24.1 R44.1 33.11,35.69 33.11,34.51 32.92,34.32 IC4.13 31.09,34.32 30.86,34.54 29.97,34.54 29.21,33.78 29.21,31.75 27.05,29.59 27.05,26.67 28.96,24.77 31.11,24.77 31.96,23.91 R43.2 R46.2
N$109
  Top 0.305: Q2.5 25.4,24.38 | 25.4,24.38 Q2.2 | IC4.7 26.31,30.75 25.78,30.23 25.78,26.8 25.4,26.42 25.4,24.38
N$110
  Top 0.305: IC11.10 29.07,19.67 29.97,20.57 R43.1
N$111
  Top 0.305: R73.1 22.95,38.7 23.5,39.24 26.92,39.24 27.3,38.86 27.3,37.08 27.71,36.68 RV14.1
N$112
  Top 0.305: Q14.1 20.32,33.76 20.32,26.42 20.95,25.78 22.86,25.78 22.99,25.65 22.99,23.11 24.64,21.46 24.64,18.92 26.42,17.14 29.84,17.14 30.48,16.51 30.48,13.84 31.5,12.83 31.5,12.45 | R25.1 31.5,12.45 | 31.5,12.45 R21.2
N$115  (via drill 0.4)
  Top 0.305: C29.1 42.61,15.3 Q7.2 43.03,15.88 IC10.5 v46.99,15.88 | IC7.3 66.15,19.7 65.41,20.45 62.61,20.45 61.46,19.3 61.46,16.64 v61.33,16.51
  Bottom 0.305: v46.99,15.88 50.04,15.88 50.67,16.51 v61.33,16.51
N$118
  Top 0.305: IC10.1 41.82,20.95 R34.1
N$119
  Top 0.305: IC5.2 44.55,34.32 43.6,35.27 C26.1 42.84,35.56 40.51,35.56 40.27,35.8 Q15.6 40.27,38.07 R76.2
N$120
  Top 0.305: IC5.1 45.3,35.03 C26.2 R18.1
N$121
  Top 0.305: Q15.5 Q15.4 42.05,36.46 43.6,38.01 R18.2
N$122
  Top 0.305: R34.2 Q11.3
N$123
  Top 0.305: Q11.1 41.91,29.72 42.15,29.96 Q19.6 42.81,31.19 R14.2
N$124
  Top 0.305: Q19.1 Q19.2 Q19.3 40.88,28.33 40.88,26.93 Q11.2
N$125
  Top 0.305: R14.1 40.55,32.13 41.77,33.35 Q15.3
N$126
  Top 0.305: R39.2 56.5,21.7 RV9.1
N$127
  Top 0.305: R5.2 55.75,36.28 55.75,32.77 55.88,32.64 56.39,32.64 56.64,32.38 56.64,29.81 R78.2 56.73,26.33 D5.2 57.81,24.95 RV9.2
N$128
  Top 0.305: Q23.3 55.03,30.82 R78.1 | R78.1 55.03,28.77 D5.3 | R77.2 55.03,30.66 R78.1
N$129
  Top 0.305: Q23.1 56.7,35.53 R5.1
N$130
  Top 0.305: IC5.9 49.92,31.72 49.38,31.18 RV10.1 49.01,29.07 48.26,28.32 48.26,25.78 49.02,25.02 R30.2
N$132  (via drill 0.4)
  Top 0.305: R50.2 R47.2 88.27,18.45 v88.27,19.56 | v54.48,23.88 48.9,23.88 47.62,25.15 47.62,32.89 49.28,34.54 50.04,34.54 50.26,34.32 IC5.13 51.97,34.32 52.16,34.51 52.16,35.69 R48.1 C27.1 R49.2 | v80.26,24.13 82.93,24.13 85.72,21.34 v85.72,19.56
  Bottom 0.305: v80.26,24.13 80.14,24.26 54.86,24.26 v54.48,23.88 | v88.27,19.56 v85.72,19.56
N$134
  Top 0.305: Q3.5 44.32,23.75 | 44.32,23.75 Q3.2 | IC5.7 45.23,30.94 45.23,28.47 44.32,27.56 44.32,23.75
N$135
  Top 0.305: IC12.2 91.41,17.81 90.93,18.29 R47.1
N$136
  Top 0.305: R76.1 42,38.7 42.55,39.24 45.97,39.24 46.35,38.86 46.35,36.96 46.63,36.68 RV15.1
N$137
  Top 0.305: Q15.1 39.37,33.76 39.37,31.11 40.13,30.35 40.13,27.56 39.88,27.3 39.88,20.32 39.37,19.81 39.37,13.68 R26.1 38.61,14.44 R22.2
N$140  (via drill 0.4)
  Top 0.305: IC10.12 52.58,15.88 53.21,15.24 55.11,15.24 C30.1 | Q8.2 56.2,15.04 C30.1 | v57.02,14.86 56.76,14.6 C30.1 | v70.74,19.94 71.63,19.94 71.87,19.7 IC7.12
  Bottom 0.305: v57.02,14.86 57.91,15.75 61.72,15.75 62.99,17.02 69.09,17.02 70.61,18.54 70.61,19.81 v70.74,19.94
N$143  (via drill 0.4)
  Top 0.305: IC10.16 51.44,20.95 v51.44,21.84 | v89.53,20.95 88.86,21.63 R35.1
  Bottom 0.305: v51.44,21.84 51.56,21.97 76.2,21.97 77.85,20.32 81.53,20.32 82.17,20.95 v89.53,20.95
N$144
  Top 0.305: IC6.2 91.54,34.32 90.59,35.27 C28.1 89.83,35.56 87.5,35.56 87.26,35.8 Q16.6 87.26,38.07 R79.2
N$145
  Top 0.305: IC6.1 92.29,35.03 C28.2 R19.1
N$146
  Top 0.305: Q16.5 Q16.4 89.04,36.46 90.59,38.01 R19.2
N$147
  Top 0.305: R35.2 88.39,24.75 Q12.3
N$148
  Top 0.305: Q12.1 88.9,26.68 88.9,29.72 89.14,29.96 Q20.6 89.8,31.19 R15.2
N$149
  Top 0.305: Q20.1 Q20.2 Q20.3 87.61,28.07 Q12.2
N$150
  Top 0.305: R15.1 87.54,32.13 88.76,33.35 Q16.3
N$151
  Top 0.305: RV11.1 103.08,22.86 R40.2
N$152
  Top 0.305: R7.2 102.74,36.28 102.74,32.77 102.87,32.64 103.38,32.64 103.63,32.38 103.63,29.81 R69.2 103.72,26.33 D6.2 104.01,25.73 104.01,19.81 103.71,19.5 RV11.2
N$153
  Top 0.305: Q24.3 102.02,30.82 R69.1 | R69.1 102.02,28.77 D6.3 | R80.2 102.02,30.66 R69.1
N$154
  Top 0.305: Q24.1 103.69,35.53 R7.1
N$155
  Top 0.305: IC6.9 97,31.72 96.37,31.09 RV12.1 96.08,29.07 95.25,28.23 95.25,26.07 R31.2
N$157  (via drill 0.4)
  Top 0.305: R53.2 100.16,38.86 C21.1 R52.1 99.15,35.69 99.15,34.51 98.96,34.32 IC6.13 97.25,34.32 97.16,34.42 96.14,34.42 94.61,32.89 94.61,22.99 96.65,20.95 v98.3,20.95 | R54.2 R51.2 102.45,17.57 v102.36,17.65
  Bottom 0.305: v98.3,20.95 101.6,17.65 v102.36,17.65
N$159
  Top 0.305: Q4.5 91.69,25.02 | 91.69,25.02 Q4.2 | IC6.7 92.35,28.72 91.69,28.07 91.69,25.02
N$160
  Top 0.305: IC12.10 99.3,15.86 99.95,16.51 R51.1
N$161
  Top 0.305: R79.1 88.99,38.7 89.53,39.24 92.96,39.24 93.34,38.86 93.34,37.08 93.75,36.68 RV16.1
N$162  (via drill 0.4)
  Top 0.305: Q16.1 86.36,33.76 86.36,22.99 87.25,22.1 v87.25,11.05 | R27.1 R23.2 v84.71,11.01
  Bottom 0.305: v84.71,11.01 87.21,11.01 v87.25,11.05
OUTPUT_OFFSET  (via drill 0.4)
  Top 0.305: v19.81,38.86 R41.1 | R45.1 v38.61,38.86 | v57.53,38.86 R49.1 57.28,38.86 58.04,38.1 58.04,28.96 61.47,25.53 61.47,20.19 60.58,19.3 60.58,15.11 61.59,14.1 64.73,14.1 SW1.2 | v104.14,40.26 103.47,39.59 R53.1
  Bottom 0.305: v19.81,38.86 v38.61,38.86 v57.53,38.86 | v104.14,40.26 104.14,10.16 100.46,6.48 71.75,6.48 67.7,10.53 SW1.2
RESET_G  (via drill 0.4)
  Top 0.305: Q5.1 2.54,16.36 v2.54,17.53 | Q7.1 40.64,16.36 v40.64,17.53 | Q6.1 15.75,16.36 v15.75,17.53 | Q8.1 53.33,17.39 v53.33,17.65 | X1.9 69.85,26.12 v69.85,23.37 69.85,18.92 v69.72,18.8 | Q25.5 Q25.2 75.17,22.73 74.55,23.36 v74.55,23.37
  Bottom 0.305: v2.54,17.53 2.67,17.65 15.62,17.65 v15.75,17.53 16.51,16.76 39.88,16.76 v40.64,17.53 40.77,17.65 47.37,17.65 47.75,17.27 48.77,17.27 49.15,17.65 v53.33,17.65 68.58,17.65 v69.72,18.8 | v74.55,23.37 v69.85,23.37
SINE_SW  (via drill 0.4)
  Top 0.305: IC11.12 IC11.13 29.49,21.62 v29.72,21.84 | IC12.13 IC12.12 96.79,17.16 96.52,16.89 v96.52,15.62 | R85.2 93.43,12.7 v93.98,13.25 | v58.93,19.57 59.31,19.18 v59.31,14.22
  Bottom 0.305: v96.52,15.62 96.52,15.49 94.27,13.25 v93.98,13.25 93.81,13.42 77.95,13.42 SW2.3 71.42,13.67 69.34,15.75 64.01,15.75 62.48,14.22 v59.31,14.22 | v58.93,19.57 58.43,20.07 43.56,20.07 41.78,21.84 v29.72,21.84
SPEED_A_CV  (via drill 0.4)
  Top 0.305: IC1.2 IC1.1 12.11,9.57 12.91,10.37 v14.44,10.37 | R84.1 30.9,9.4 25.91,9.4 24.38,7.87 22.61,7.87 20.55,9.93 18.13,9.93 17.69,10.37 v16.38,10.37 | R84.1 R83.1 | R86.1 v57.78,8.26 R92.1 | R84.1 32.68,8.55 v33.02,8.89
  Bottom 0.305: v16.38,10.37 v14.44,10.37 | v57.78,8.26 56.52,9.53 33.66,9.53 v33.02,8.89
SPEED_A_CV_IN  (via drill 0.4)
  Top 0.305: RV2.3 36.83,3.43 36.83,11.68 37.08,11.94 37.08,15.11 38.73,16.76 38.73,20.45 39.24,20.95 39.24,27.8 v39.37,27.93
  Bottom 0.305: X1.13 65.32,26.79 61.09,26.79 59.94,27.93 v39.37,27.93
SPEED_A_POT  (via drill 0.4)
  Top 0.305: R63.1 v59.69,8.26 R62.1 | IC1.6 IC1.7 11.66,5.08 29.34,5.08 30.61,6.35 33.44,6.35 R60.1 | R60.1 R61.1 | R60.1 35.14,7.2 v35.56,7.62
  Bottom 0.305: v59.69,8.26 58.8,7.37 53.34,7.37 53.09,7.62 v35.56,7.62
SPEED_B_CV
  Top 0.305: X1.3 78.08,25.43 78.61,24.89 83.19,24.89 86.49,21.59 86.49,9.53 92.71,3.3 RV4.2
SPREAD_CV  (via drill 0.4)
  Top 0.305: IC1.14 IC1.13 16.9,8.89 20.61,8.89 22.31,7.2 24.68,7.2 26.04,8.55 R67.1 26.5,8.72 27.6,8.72 v27.94,8.38 | R65.1 v55.88,8.26 R91.1
  Bottom 0.305: v55.88,8.26 55.17,8.97 34.37,8.97 33.27,7.87 28.45,7.87 v27.94,8.38
SPREAD_CV_IN  (via drill 0.4)
  Top 0.305: IC1.12 15.86,8.27 15.24,8.89 15.24,10.41 16,11.18 25.15,11.18 25.4,11.43 35.81,11.43 36.45,12.06 36.45,15.49 38.1,17.14 38.1,20.7 38.48,21.08 38.48,28.41 v38.73,28.7
  Bottom 0.305: v38.73,28.7 60.45,28.7 61.2,27.94 66.71,27.94 X1.11
SPREAD_POT  (via drill 0.4)
  Top 0.305: IC1.9 IC1.8 28.4,5.67 v29.72,6.99 29.59,6.99 29.21,7.37 R66.1 | R64.1 v53.98,8.26 R89.1
  Bottom 0.305: v53.98,8.26 34.92,8.26 33.66,6.99 v29.72,6.99
SQ_-5V  (via drill 0.4)
  Top 0.305: Q1.3 7.86,24.5 v7.87,24.51 | v45.21,25.4 45.22,25.39 Q3.3 | v27.3,24.64 27.05,24.64 26.55,25.13 Q2.3 | Q4.3 92.59,26.66 v92.58,26.67
  Bottom 0.305: v7.87,24.51 8.38,25.02 26.67,25.02 27.05,24.64 v27.3,24.64 36.32,24.64 36.83,24.13 41.78,24.13 43.05,25.4 v45.21,25.4 45.34,25.53 91.44,25.53 v92.58,26.67 92.58,20.95 91.69,20.07 89.15,20.07 88.9,20.32 82.68,20.32 81.41,19.05 JP1.2
SQ_SW  (via drill 0.4)
  Top 0.305: IC11.5 IC11.6 21.43,19.02 21.21,18.8 21.21,18.03 v21.59,17.65 | IC12.5 IC12.6 89.8,15.21 R81.2 88.99,14.95 88.39,14.35 88.39,10.29 v88.27,10.16 | SW2.1 75.84,6.73 v67.69,6.73 | v48.26,14.86 v48.26,17.91
  Bottom 0.305: SW2.1 79.27,10.16 v88.27,10.16 | v21.59,17.65 21.72,17.53 21.84,17.53 21.97,17.4 38.35,17.4 39.37,18.41 40.89,18.41 41.15,18.16 48.01,18.16 v48.26,17.91 | v67.69,6.73 66.93,6.73 64.77,8.89 64.77,10.16 63.5,11.43 49.53,11.43 48.26,12.7 v48.26,14.86

## Text on the board
tPlace: -12V | otterley B v1.2 | GND | (c) 2023 | expert | sleepers